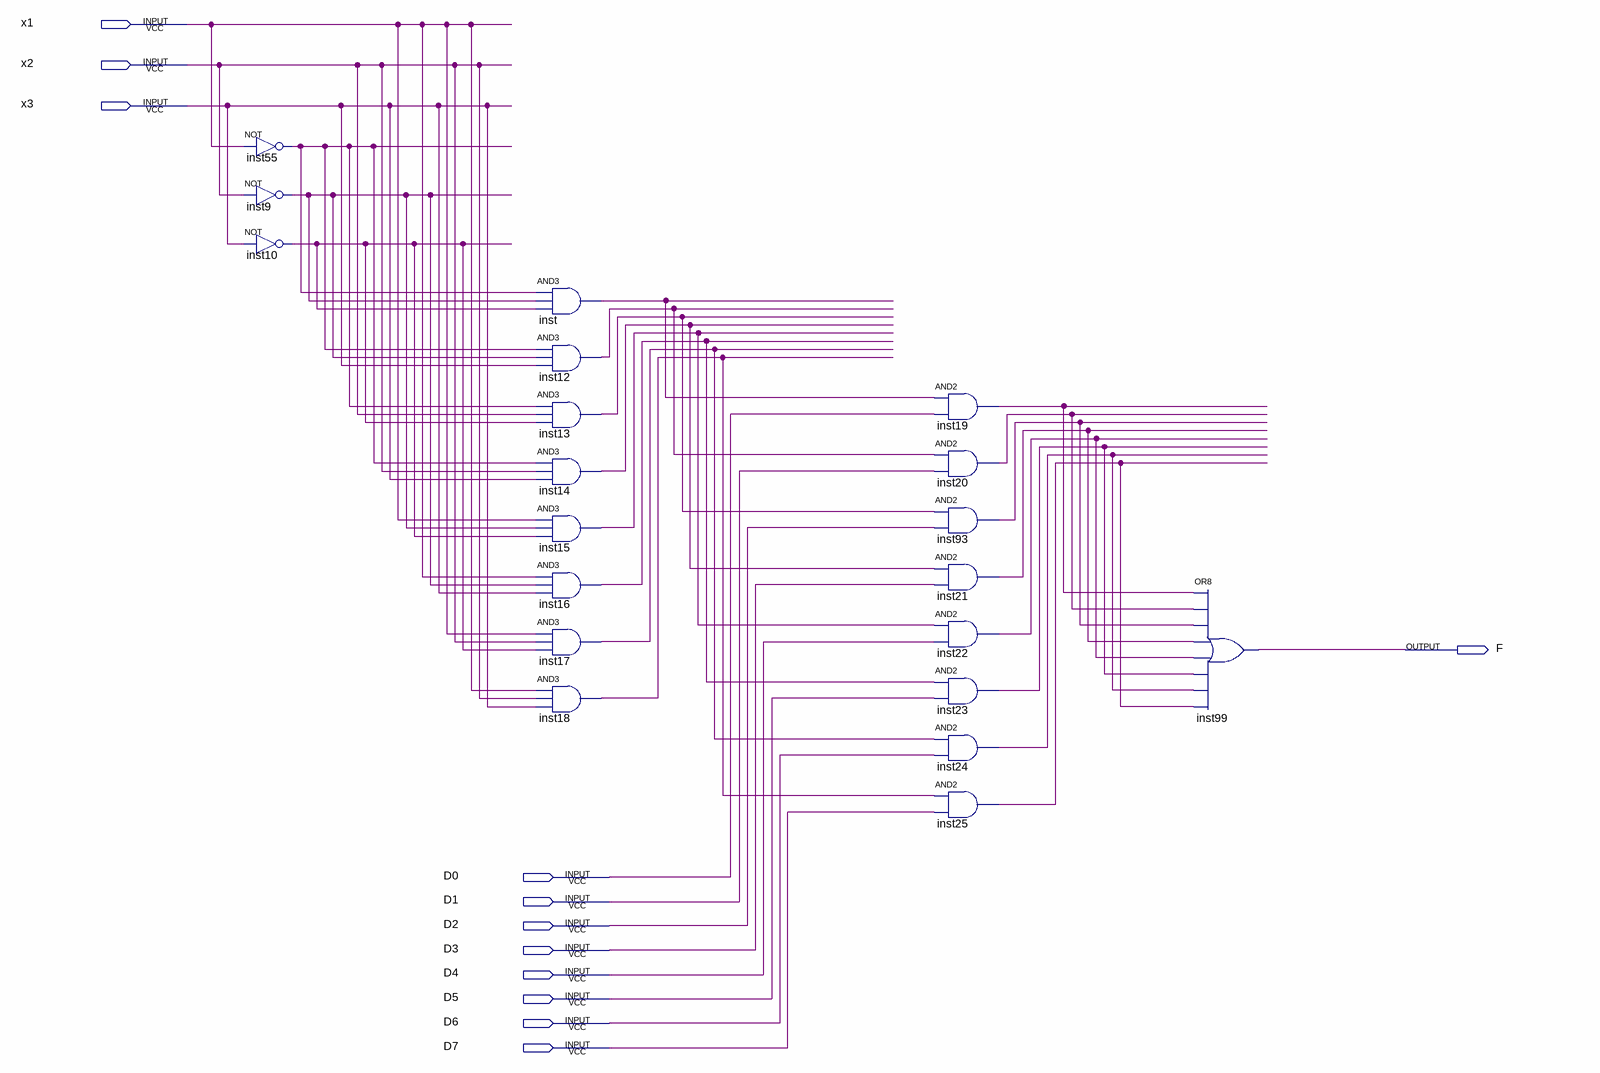
[diagram p0: schematic sheet]
// Quartus schematic Isaev21.bdf as structural Verilog: 20 symbols, 12 pins
module Isaev21 (
  input  x1,
  input  x2,
  input  x3,
  input  D0,
  input  D1,
  input  D2,
  input  D3,
  input  D4,
  input  D5,
  input  D6,
  input  D7,
  output F
);

  wire inst9_out, inst10_out, inst12_out, inst13_out, inst14_out, inst15_out, inst16_out, inst17_out,
       inst18_out, inst19_out, inst20_out, inst21_out, inst22_out, inst23_out, inst24_out, inst25_out,
       inst55_out, inst93_out, inst_out;

  not inst55 (inst55_out, x1);
  not inst9 (inst9_out, x2);
  not inst10 (inst10_out, x3);
  and inst (inst_out, inst55_out, inst9_out, inst10_out);
  and inst12 (inst12_out, inst55_out, inst9_out, x3);
  and inst13 (inst13_out, inst55_out, x2, inst10_out);
  and inst14 (inst14_out, inst55_out, x2, x3);
  and inst15 (inst15_out, x1, inst9_out, inst10_out);
  and inst16 (inst16_out, x1, inst9_out, x3);
  and inst17 (inst17_out, x1, x2, inst10_out);
  and inst18 (inst18_out, x1, x2, x3);
  and inst19 (inst19_out, inst_out, D0);
  and inst20 (inst20_out, inst12_out, D1);
  and inst93 (inst93_out, inst13_out, D2);
  and inst21 (inst21_out, inst14_out, D3);
  and inst22 (inst22_out, inst15_out, D4);
  and inst23 (inst23_out, inst16_out, D5);
  and inst24 (inst24_out, inst17_out, D6);
  and inst25 (inst25_out, inst18_out, D7);
  or inst99 (F, inst19_out, inst20_out, inst93_out, inst21_out, inst22_out, inst23_out, inst24_out, inst25_out);
endmodule
